# Altium schematic sheet nm_mcu.SchDoc: =GlobalProjectName
size 410 x 297 mm; SheetNumber: 2; SheetTotal: 9; PageSetup: Record=PageOptions|CenterHorizontal=True|CenterVertical=True|PrintScale=1.00|XCorrection=1.00|YCorrection=1.00|PrintKind=1|BorderSize=5000000|LeftOffset=0|BottomOffset=0|Orientation=2|PaperLength=1000|PaperWidth=1000|Scale=100|PaperSource=15|PrintQuality=1200|MediaType=1|DitherType=10|PaperKind=A3|PrintScaleMode=1; Weight: -; ScaleFactor: -
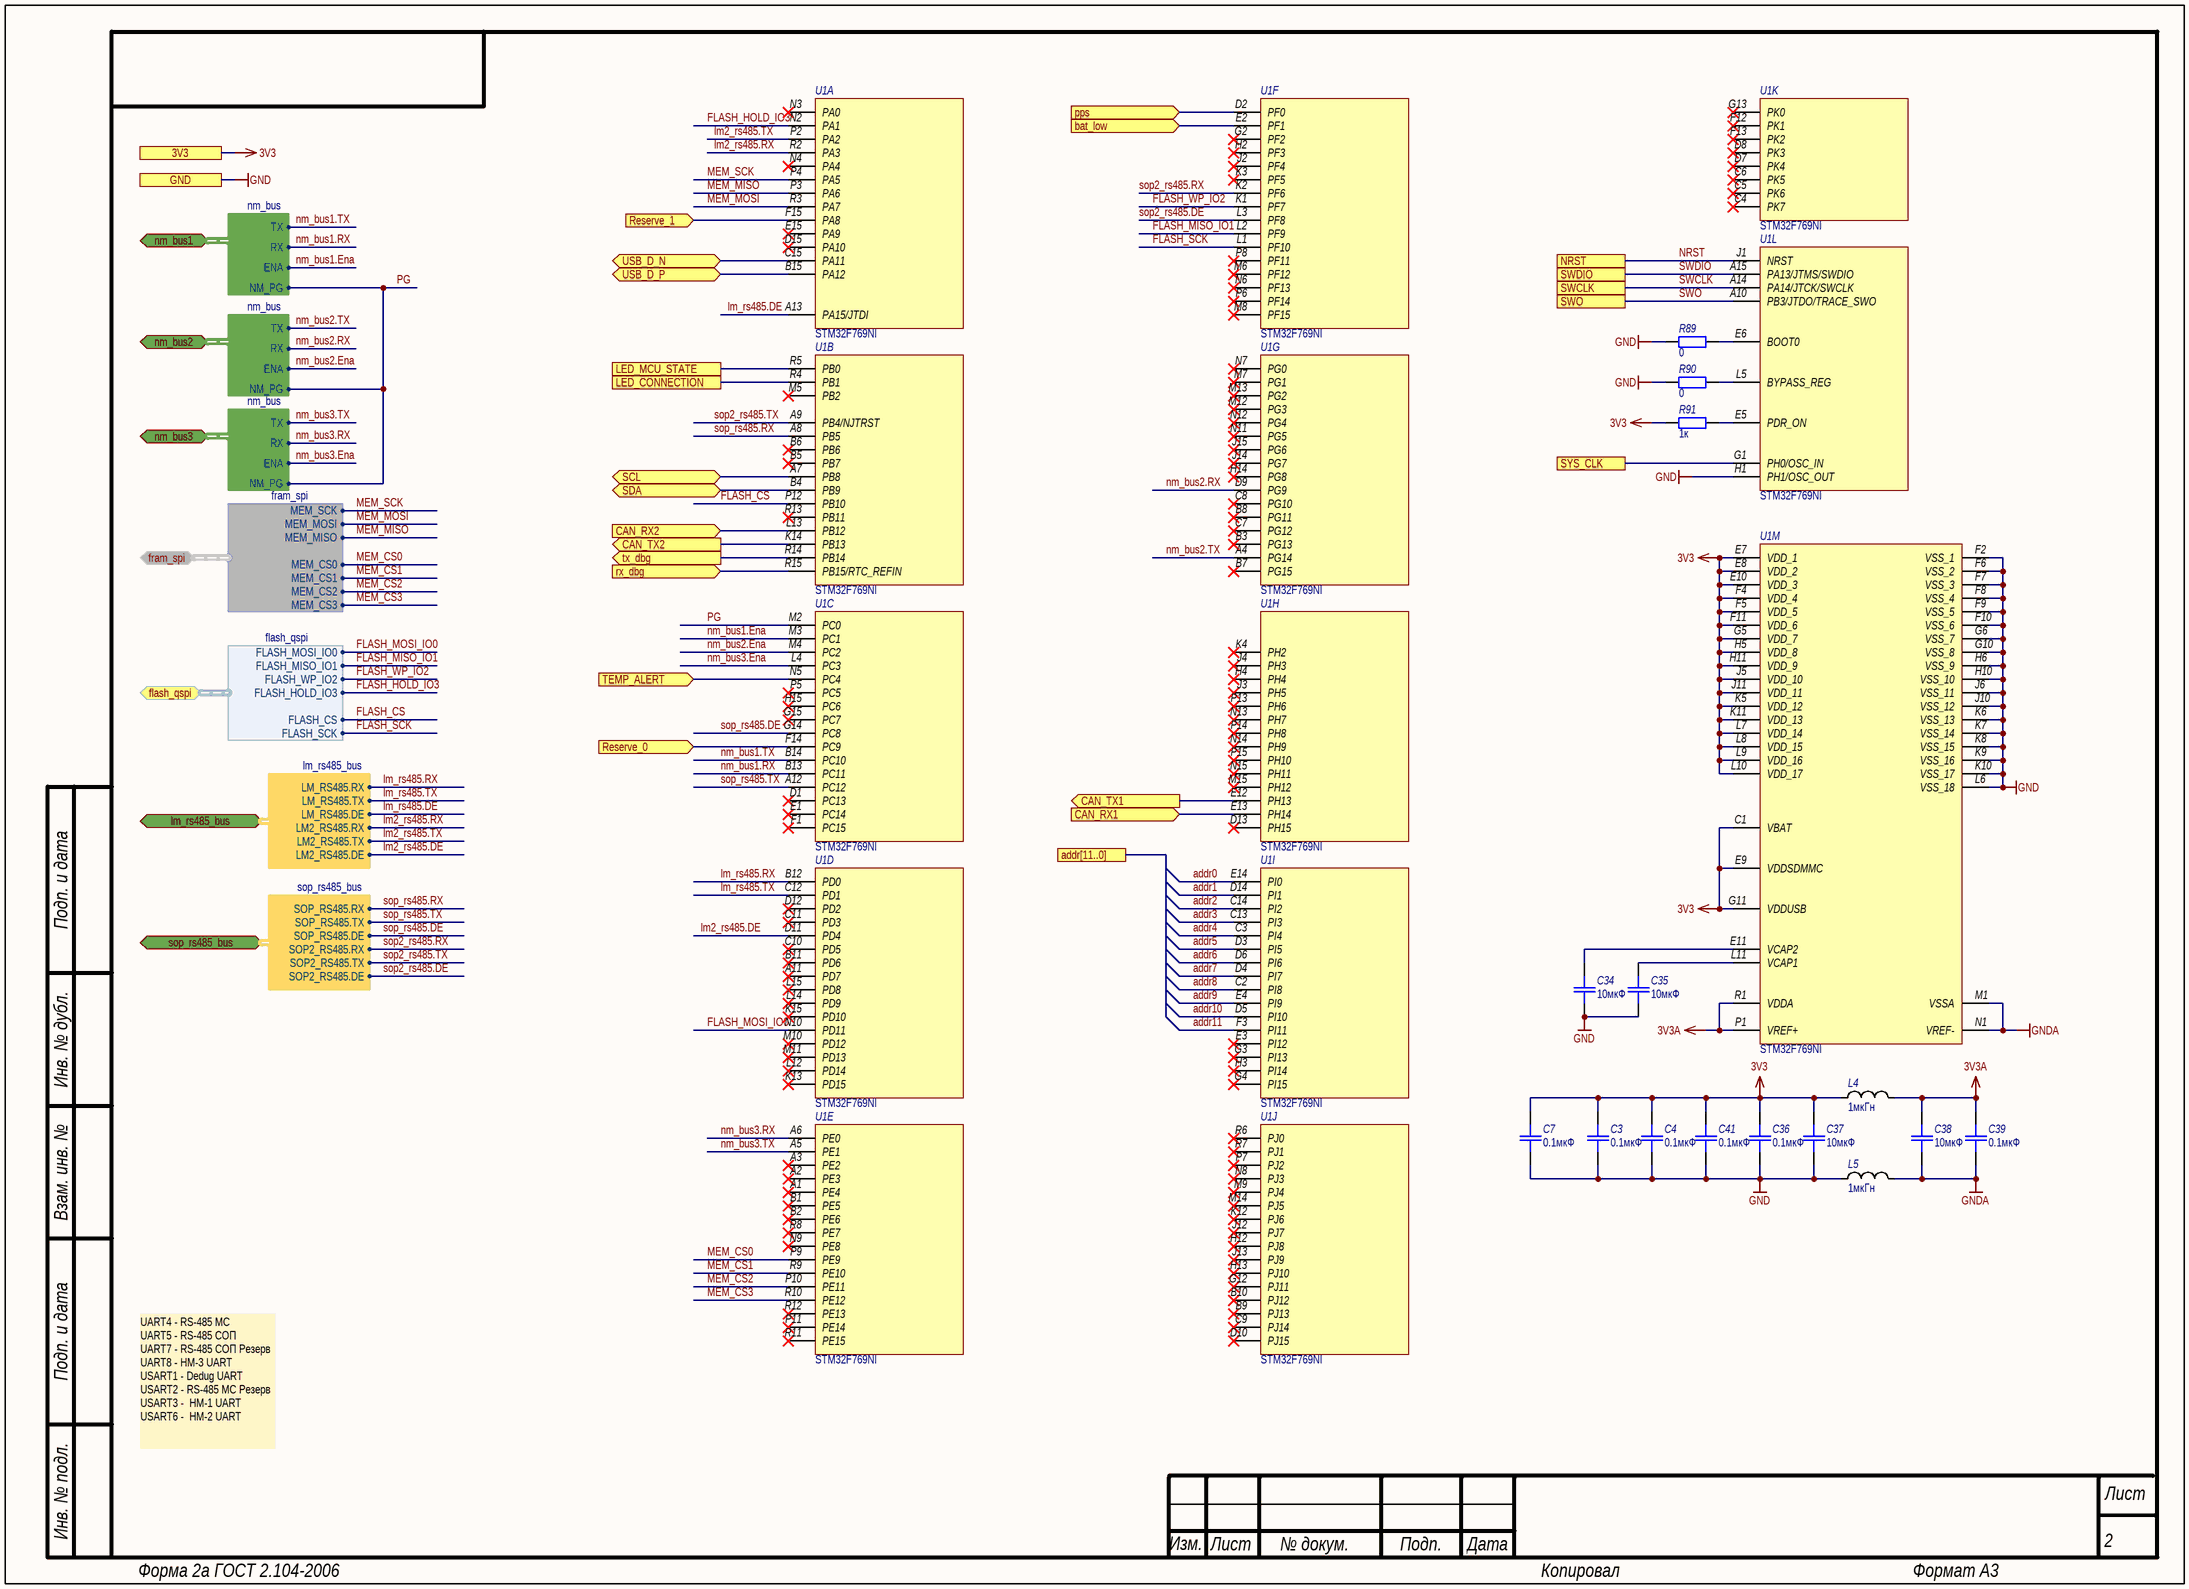
[diagram p0: nm_mcu.SchDoc]

## Parts
C3  0.1мкФ  [SMD_C0603]
C4  0.1мкФ  [SMD_C0603]
C7  0.1мкФ  [SMD_C0603]
C34  value 10мкФ  [SMD_C0603]  (hidden comment: Capacitor)
C35  value 10мкФ  [SMD_C0603]  (hidden comment: Capacitor)
C36  0.1мкФ  [SMD_C0603]
C37  10мкФ  [SMD_C0603]
C38  10мкФ  [SMD_C0603]
C39  0.1мкФ  [SMD_C0603]
C41  0.1мкФ  [SMD_C0603]
L4  1мкГн  [SMD_0805]
L5  1мкГн  [SMD_0805]
R89  value 0  [SMD_0603]  (hidden comment: Resistor)
R90  value 0  [SMD_0603]  (hidden comment: Resistor)
R91  value 1к  [SMD_0603]  (hidden comment: Resistor)
U1  STM32F769NI  [BGA216C80P15X15_1300X1300X110]  (parts A,B,C,D,E,F,G,H,I,J,K,L,M of 13)

## Ports
3V3, addr[11..0], bat_low (in), CAN_RX1 (in), CAN_RX2 (in), CAN_TX1 (out), CAN_TX2 (out), flash_qspi (bidir, harness flash_qspi), fram_spi (bidir, harness fram_spi), GND, LED_CONNECTION, LED_MCU_STATE, lm_rs485_bus (bidir, harness lm_rs485_bus), nm_bus1 (bidir, harness nm_bus), nm_bus2 (bidir, harness nm_bus), nm_bus3 (bidir, harness nm_bus), NRST, pps (in), Reserve_0 (in), Reserve_1 (in), rx_dbg (in), SCL (bidir), SDA (bidir), sop_rs485_bus (bidir, harness sop_rs485_bus), SWCLK, SWDIO, SWO, SYS_CLK, TEMP_ALERT (in), tx_dbg (out), USB_D_N (bidir), USB_D_P (bidir)

## Harnesses
fram_spi: MEM_SCK, MEM_MOSI, MEM_MISO, MEM_CS0, MEM_CS1, MEM_CS2, MEM_CS3
flash_qspi: FLASH_MOSI_IO0, FLASH_MISO_IO1, FLASH_WP_IO2, FLASH_HOLD_IO3, FLASH_CS, FLASH_SCK
nm_bus: TX, RX, ENA, NM_PG
lm_rs485_bus: LM_RS485.RX, LM_RS485.TX, LM_RS485.DE, LM2_RS485.RX, LM2_RS485.TX, LM2_RS485.DE
sop_rs485_bus: SOP_RS485.RX, SOP_RS485.TX, SOP_RS485.DE, SOP2_RS485.RX, SOP2_RS485.TX, SOP2_RS485.DE

## Nets
3V3: C3.2 C4.2 C7.2 C36.2 C37.2 C41.2 L4.1 R91.1 U1.C1(VBAT) U1.E7(VDD_1) U1.E8(VDD_2) U1.E9(VDDSDMMC) U1.E10(VDD_3) U1.F4(VDD_4) U1.F5(VDD_5) U1.F11(VDD_6) U1.G5(VDD_7) U1.G11(VDDUSB) U1.H5(VDD_8) U1.H11(VDD_9) U1.J5(VDD_10) U1.J11(VDD_11) U1.K5(VDD_12) U1.K11(VDD_13) U1.L7(VDD_14) U1.L8(VDD_15) U1.L9(VDD_16) U1.L10(VDD_17) ; port 3V3
3V3A: C38.2 C39.2 L4.2 U1.P1(VREF+) U1.R1(VDDA)
GND: C3.1 C4.1 C7.1 C34.1 C35.1 C36.1 C37.1 C41.1 L5.1 R89.1 R90.1 U1.F2(VSS_1) U1.F6(VSS_2) U1.F7(VSS_3) U1.F8(VSS_4) U1.F9(VSS_5) U1.F10(VSS_6) U1.G6(VSS_7) U1.G10(VSS_8) U1.H1(PH1/OSC_OUT) U1.H6(VSS_9) U1.H10(VSS_10) U1.J6(VSS_11) U1.J10(VSS_12) U1.K6(VSS_13) U1.K7(VSS_14) U1.K8(VSS_15) U1.K9(VSS_16) U1.K10(VSS_17) U1.L6(VSS_18) ; port GND
GNDA: C38.1 C39.1 L5.2 U1.M1(VSSA) U1.N1(VREF-)
addr0: U1.E14(PI0)
addr1: U1.D14(PI1)
addr2: U1.C14(PI2)
addr3: U1.C13(PI3)
addr4: U1.C3(PI4)
addr5: U1.D3(PI5)
addr6: U1.D6(PI6)
addr7: U1.D4(PI7)
addr8: U1.C2(PI8)
addr9: U1.E4(PI9)
addr10: U1.D5(PI10)
addr11: U1.F3(PI11)
bat_low: U1.E2(PF1) ; port bat_low
CAN_RX1: U1.E13(PH14) ; port CAN_RX1
CAN_RX2: U1.L13(PB12) ; port CAN_RX2
CAN_TX1: U1.E12(PH13) ; port CAN_TX1
CAN_TX2: U1.K14(PB13) ; port CAN_TX2
FLASH_CS: U1.P12(PB10) ; port flash_qspi.FLASH_CS
FLASH_HOLD_IO3: U1.N2(PA1) ; port flash_qspi.FLASH_HOLD_IO3
FLASH_MISO_IO1: U1.L2(PF9) ; port flash_qspi.FLASH_MISO_IO1
FLASH_MOSI_IO0: U1.N10(PD11) ; port flash_qspi.FLASH_MOSI_IO0
FLASH_SCK: U1.L1(PF10) ; port flash_qspi.FLASH_SCK
FLASH_WP_IO2: U1.K1(PF7) ; port flash_qspi.FLASH_WP_IO2
LED_CONNECTION: U1.R4(PB1) ; port LED_CONNECTION
LED_MCU_STATE: U1.R5(PB0) ; port LED_MCU_STATE
lm2_rs485.DE: U1.D11(PD4) ; port lm_rs485_bus.LM2_RS485.DE
lm2_rs485.RX: U1.R2(PA3) ; port lm_rs485_bus.LM2_RS485.RX
lm2_rs485.TX: U1.P2(PA2) ; port lm_rs485_bus.LM2_RS485.TX
lm_rs485.DE: U1.A13(PA15/JTDI) ; port lm_rs485_bus.LM_RS485.DE
lm_rs485.RX: U1.B12(PD0) ; port lm_rs485_bus.LM_RS485.RX
lm_rs485.TX: U1.C12(PD1) ; port lm_rs485_bus.LM_RS485.TX
MEM_CS0: U1.P9(PE9) ; port fram_spi.MEM_CS0
MEM_CS1: U1.R9(PE10) ; port fram_spi.MEM_CS1
MEM_CS2: U1.P10(PE11) ; port fram_spi.MEM_CS2
MEM_CS3: U1.R10(PE12) ; port fram_spi.MEM_CS3
MEM_MISO: U1.P3(PA6) ; port fram_spi.MEM_MISO
MEM_MOSI: U1.R3(PA7) ; port fram_spi.MEM_MOSI
MEM_SCK: U1.P4(PA5) ; port fram_spi.MEM_SCK
nm_bus1.Ena: U1.M3(PC1) ; port nm_bus1.ENA
nm_bus1.RX: U1.B13(PC11) ; port nm_bus1.RX
nm_bus1.TX: U1.B14(PC10) ; port nm_bus1.TX
nm_bus2.Ena: U1.M4(PC2) ; port nm_bus2.ENA
nm_bus2.RX: U1.D9(PG9) ; port nm_bus2.RX
nm_bus2.TX: U1.A4(PG14) ; port nm_bus2.TX
nm_bus3.Ena: U1.L4(PC3) ; port nm_bus3.ENA
nm_bus3.RX: U1.A6(PE0) ; port nm_bus3.RX
nm_bus3.TX: U1.A5(PE1) ; port nm_bus3.TX
NRST: U1.J1(NRST) ; port NRST
PG: U1.M2(PC0) ; port nm_bus1.NM_PG, port nm_bus2.NM_PG, port nm_bus3.NM_PG
pps: U1.D2(PF0) ; port pps
Reserve_0: U1.F14(PC9) ; port Reserve_0
Reserve_1: U1.F15(PA8) ; port Reserve_1
rx_dbg: U1.R15(PB15/RTC_REFIN) ; port rx_dbg
SCL: U1.A7(PB8) ; port SCL
SDA: U1.B4(PB9) ; port SDA
sop2_rs485.DE: U1.L3(PF8) ; port sop_rs485_bus.SOP2_RS485.DE
sop2_rs485.RX: U1.K2(PF6) ; port sop_rs485_bus.SOP2_RS485.RX
sop2_rs485.TX: U1.A9(PB4/NJTRST) ; port sop_rs485_bus.SOP2_RS485.TX
sop_rs485.DE: U1.G14(PC8) ; port sop_rs485_bus.SOP_RS485.DE
sop_rs485.RX: U1.A8(PB5) ; port sop_rs485_bus.SOP_RS485.RX
sop_rs485.TX: U1.A12(PC12) ; port sop_rs485_bus.SOP_RS485.TX
SWCLK: U1.A14(PA14/JTCK/SWCLK) ; port SWCLK
SWDIO: U1.A15(PA13/JTMS/SWDIO) ; port SWDIO
SWO: U1.A10(PB3/JTDO/TRACE_SWO) ; port SWO
SYS_CLK: U1.G1(PH0/OSC_IN) ; port SYS_CLK
TEMP_ALERT: U1.N5(PC4) ; port TEMP_ALERT
tx_dbg: U1.R14(PB14) ; port tx_dbg
USB_D_N: U1.C15(PA11) ; port USB_D_N
USB_D_P: U1.B15(PA12) ; port USB_D_P
NetC34_2: C34.2 U1.E11(VCAP2)
NetC35_2: C35.2 U1.L11(VCAP1)
NetR89_2: R89.2 U1.E6(BOOT0)
NetR90_2: R90.2 U1.L5(BYPASS_REG)
NetR91_2: R91.2 U1.E5(PDR_ON)

Not connected (* = marked no-connect by the designer): U1 A1(PE4)* A2(PE3)* A3(PE2)* A11(PD7)* B1(PE5)* B2(PE6)* B3(PG13)* B5(PB7)* B6(PB6)* B7(PG15)* B8(PG11)* B9(PJ13)* B10(PJ12)* B11(PD6)* C4(PK7)* C5(PK6)* C6(PK5)* C7(PG12)* C8(PG10)* C9(PJ14)* C10(PD5)* C11(PD3)* D1(PC13)* D7(PK4)* D8(PK3)* D10(PJ15)* D12(PD2)* D13(PH15)* D15(PA10)* E1(PC14)* E3(PI12)* E15(PA9)* F1(PC15)* F12(PK1)* F13(PK2)* G2(PF2)* G3(PI13)* G4(PI15)* G12(PJ11)* G13(PK0)* G15(PC7)* H2(PF3)* H3(PI14)* H4(PH4)* H12(PJ8)* H13(PJ10)* H14(PG8)* H15(PC6)* J2(PF4)* J3(PH5)* J4(PH3)* J12(PJ7)* J13(PJ9)* J14(PG7)* J15(PG6)* K3(PF5)* K4(PH2)* K12(PJ6)* K13(PD15)* K15(PD10)* L12(PD14)* L14(PD9)* L15(PD8)* M5(PB2)* M6(PF12)* M7(PG1)* M8(PF15)* M9(PJ4)* M10(PD12)* M11(PD13)* M12(PG3)* M13(PG2)* M14(PJ5)* M15(PH12)* N3(PA0)* N4(PA4)* N6(PF13)* N7(PG0)* N8(PJ3)* N9(PE8)* N11(PG5)* N12(PG4)* N13(PH7)* N14(PH9)* N15(PH11)* P5(PC5)* P6(PF14)* P7(PJ2)* P8(PF11)* P11(PE14)* P13(PH6)* P14(PH8)* P15(PH10)* R6(PJ0)* R7(PJ1)* R8(PE7)* R11(PE15)* R12(PE13)* R13(PB11)*

## Notes on the sheet
- UART4 - RS-485 МС
  UART5 - RS-485 СОП
  UART7 - RS-485 СОП Резерв
  UART8 - НМ-3 UART
  USART1 - Dedug UART
  USART2 - RS-485 МС Резерв
  USART3 -  НМ-1 UART
  USART6 -  НМ-2 UART
- Подп. и дата
- Инв. № дубл.
- Взам. инв. №
- Инв. № подл.
- Изм.
- Лист
- № докум.
- Подп.
- Дата
- Форма 2а ГОСТ 2.104-2006
- Копировал
- Формат А3

## Library data of the parts
C3 C4 C7 C36-C39 C41 = Capacitor: Назначение: SMD-конденсатор; Наименование: Конденсатор; Потребление, Вт: 0; Place_v1: *; Place_v2: *
  C3 C4 C7 C36 C39 C41: Value: 0.1мкФ
  C37 C38: Value: 10мкФ
C34 C35 = Capacitor: Назначение: SMD-конденсатор; Наименование: Конденсатор; Потребление, Вт: 0; Точность: %; Напряжение: В; Диэлектрик: *; Place_v1: *; Place_v2: *
L4 L5 = Inductor: Наименование: Индуктивность; Назначение: SMD-индуктивность; Потребление, Вт: 0,010; Value: 1мкГн; Place_v1: *; Place_v2: *
R89-R91 = Resistor: Наименование: Резистор; Назначение: SMD-резистор; Потребление, Вт: 0,001; Точность: %; Place_v1: *; Place_v2: *
U1 = STM32F769NI: High-performance and DSP with FPU, Arm Cortex-M7 MCU with 2 Mbytes of Flash memory, 216 MHz CPU, Art Accelerator, L1 cache, SDRAM, TFT, MIPI-DSI, JPEG codec, DFSDM; Потребление, Вт: 0.01; Назначение: Arm Cortex-M7 MCU; ComponentLink1Description: DataSheet; ComponentLink1URL: https://www.st.com/resource/en/datasheet/stm32f769ni.pdf; Наименование: STM32F769NI